# Altium schematic sheet p01_main.SchDoc
size A4
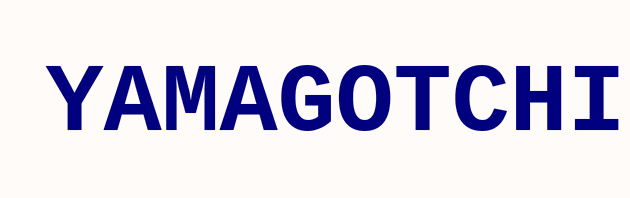
[diagram p0: p01_main.SchDoc]

## Notes on the sheet
- YAMAGOTCHI